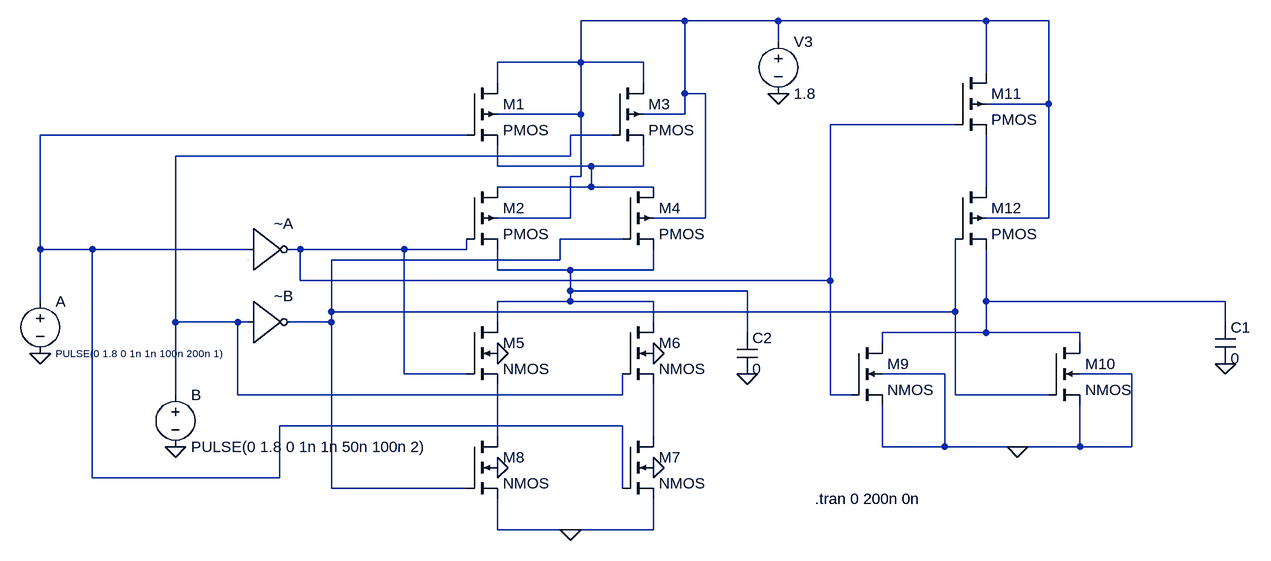
[diagram p0: schematic adder.asc]
adder.asc, the LTspice schematic file:
Version 4
SHEET 1 1160 756
WIRE 288 -48 128 -48
WIRE 432 -48 288 -48
WIRE 752 -48 432 -48
WIRE 848 -48 752 -48
WIRE 432 -16 432 -48
WIRE 128 16 128 -48
WIRE 128 16 0 16
WIRE 224 16 128 16
WIRE 752 32 752 -48
WIRE 0 48 0 16
WIRE 224 48 224 16
WIRE 288 64 288 -48
WIRE 320 64 288 64
WIRE 848 80 848 -48
WIRE 848 80 752 80
WIRE 128 96 128 16
WIRE 128 96 0 96
WIRE 288 96 288 64
WIRE 288 96 224 96
WIRE 704 112 512 112
WIRE -48 128 -704 128
WIRE 176 128 112 128
WIRE 112 160 112 128
WIRE 112 160 -496 160
WIRE 0 176 0 144
WIRE 144 176 0 176
WIRE 224 176 224 144
WIRE 224 176 144 176
WIRE 128 192 128 96
WIRE 128 192 112 192
WIRE 144 208 144 176
WIRE 144 208 0 208
WIRE 240 208 144 208
WIRE 752 208 752 128
WIRE 112 256 112 192
WIRE 112 256 0 256
WIRE 320 256 320 64
WIRE 320 256 240 256
WIRE 848 256 848 80
WIRE 848 256 752 256
WIRE 192 288 96 288
WIRE -704 304 -704 128
WIRE -624 304 -704 304
WIRE -384 304 -624 304
WIRE -304 304 -320 304
WIRE -144 304 -304 304
WIRE -48 304 -48 288
WIRE -48 304 -144 304
WIRE 96 320 96 288
WIRE 96 320 -256 320
WIRE 0 336 0 304
WIRE 112 336 0 336
WIRE 240 336 240 304
WIRE 240 336 112 336
WIRE -304 352 -304 304
WIRE 512 352 512 112
WIRE 512 352 -304 352
WIRE 112 368 112 336
WIRE 384 368 112 368
WIRE -704 384 -704 304
WIRE 112 384 112 368
WIRE 112 384 0 384
WIRE 240 384 112 384
WIRE 752 384 752 304
WIRE 1120 384 752 384
WIRE -256 400 -256 320
WIRE 704 400 704 288
WIRE 704 400 -256 400
WIRE -496 416 -496 160
WIRE -400 416 -496 416
WIRE -384 416 -400 416
WIRE -256 416 -256 400
WIRE -256 416 -320 416
WIRE 0 416 0 384
WIRE 240 416 240 384
WIRE 1120 416 1120 384
WIRE 384 432 384 368
WIRE 752 432 752 384
WIRE 752 432 592 432
WIRE 896 432 752 432
WIRE 592 448 592 432
WIRE 896 448 896 432
WIRE -144 496 -144 304
WIRE -48 496 -144 496
WIRE 688 496 592 496
WIRE 976 496 896 496
WIRE -496 528 -496 416
WIRE -400 528 -400 416
WIRE 192 528 192 496
WIRE 192 528 -400 528
WIRE 512 528 512 352
WIRE 544 528 512 528
WIRE 704 528 704 400
WIRE 848 528 704 528
WIRE 192 576 -336 576
WIRE 0 592 0 512
WIRE 240 592 240 512
WIRE 592 608 592 544
WIRE 688 608 688 496
WIRE 688 608 592 608
WIRE 800 608 688 608
WIRE 896 608 896 544
WIRE 896 608 800 608
WIRE 976 608 976 496
WIRE 976 608 896 608
WIRE -624 656 -624 304
WIRE -336 656 -336 576
WIRE -336 656 -624 656
WIRE -256 672 -256 416
WIRE -48 672 -256 672
WIRE 192 672 192 576
WIRE 0 736 0 688
WIRE 112 736 0 736
WIRE 240 736 240 688
WIRE 240 736 112 736
FLAG -704 464 0
FLAG -496 608 0
FLAG 432 64 0
FLAG 112 736 0
FLAG 0 640 0
FLAG 0 464 0
FLAG 240 464 0
FLAG 240 640 0
FLAG 384 496 0
FLAG 1120 480 0
FLAG 800 608 0
SYMBOL pmos4 -48 48 R0
SYMATTR InstName M1
SYMBOL pmos4 -48 208 R0
SYMATTR InstName M2
SYMBOL pmos4 176 48 R0
SYMATTR InstName M3
SYMBOL pmos4 192 208 R0
SYMATTR InstName M4
SYMBOL nmos4 -48 416 R0
SYMATTR InstName M5
SYMBOL nmos4 192 416 R0
SYMATTR InstName M6
SYMBOL nmos4 192 592 R0
SYMATTR InstName M7
SYMBOL nmos4 -48 592 R0
SYMATTR InstName M8
SYMBOL Digital\\inv -384 240 R0
SYMATTR InstName ~A
SYMBOL Digital\\inv -384 352 R0
SYMATTR InstName ~B
SYMBOL voltage -704 368 R0
WINDOW 3 24 96 Left 1
WINDOW 123 0 0 Left 0
WINDOW 39 0 0 Left 0
SYMATTR InstName A
SYMATTR Value PULSE(0 1.8 0 1n 1n 100n 200n 1)
SYMBOL voltage -496 512 R0
WINDOW 123 0 0 Left 0
WINDOW 39 0 0 Left 0
SYMATTR InstName B
SYMATTR Value PULSE(0 1.8 0 1n 1n 50n 100n 2)
SYMBOL voltage 432 -32 R0
WINDOW 123 0 0 Left 0
WINDOW 39 0 0 Left 0
SYMATTR InstName V3
SYMATTR Value 1.8
SYMBOL nmos4 544 448 R0
SYMATTR InstName M9
SYMBOL nmos4 848 448 R0
SYMATTR InstName M10
SYMBOL pmos4 704 32 R0
SYMATTR InstName M11
SYMBOL pmos4 704 208 R0
SYMATTR InstName M12
SYMBOL cap 1104 416 R0
SYMATTR InstName C1
SYMATTR Value 0
SYMBOL cap 368 432 R0
SYMATTR InstName C2
SYMATTR Value 0
TEXT 488 688 Left 2 !.tran 0 200n 0n

The netlist it stands for:
* adder.asc
M1 N001 N003 N005 N001 PMOS
M2 N005 N002 N008 N001 PMOS
M3 N001 N004 N005 N001 PMOS
M4 N005 N007 N008 N001 PMOS
M5 N008 N002 N010 0 NMOS
M6 N008 N004 N011 0 NMOS
M7 N011 N003 0 0 NMOS
M8 N010 N007 0 0 NMOS
A§~A N003 0 0 0 0 N002 0 0 BUF
A§~B N004 0 0 0 0 N007 0 0 BUF
V§A N003 0 PULSE(0 1.8 0 1n 1n 100n 200n 1)
V§B N004 0 PULSE(0 1.8 0 1n 1n 50n 100n 2)
V3 N001 0 1.8
M9 N009 N002 0 0 NMOS
M10 N009 N007 0 0 NMOS
M11 N001 N002 N006 N001 PMOS
M12 N006 N007 N009 N001 PMOS
C1 N009 0 0
C2 N008 0 0
.model NMOS NMOS
.model PMOS PMOS
.lib standard.mos
.tran 0 200n 0n
.backanno
.end